# EAGLE schematic EKSR_Instrument_Rev_B (EAGLE 9.7.0)
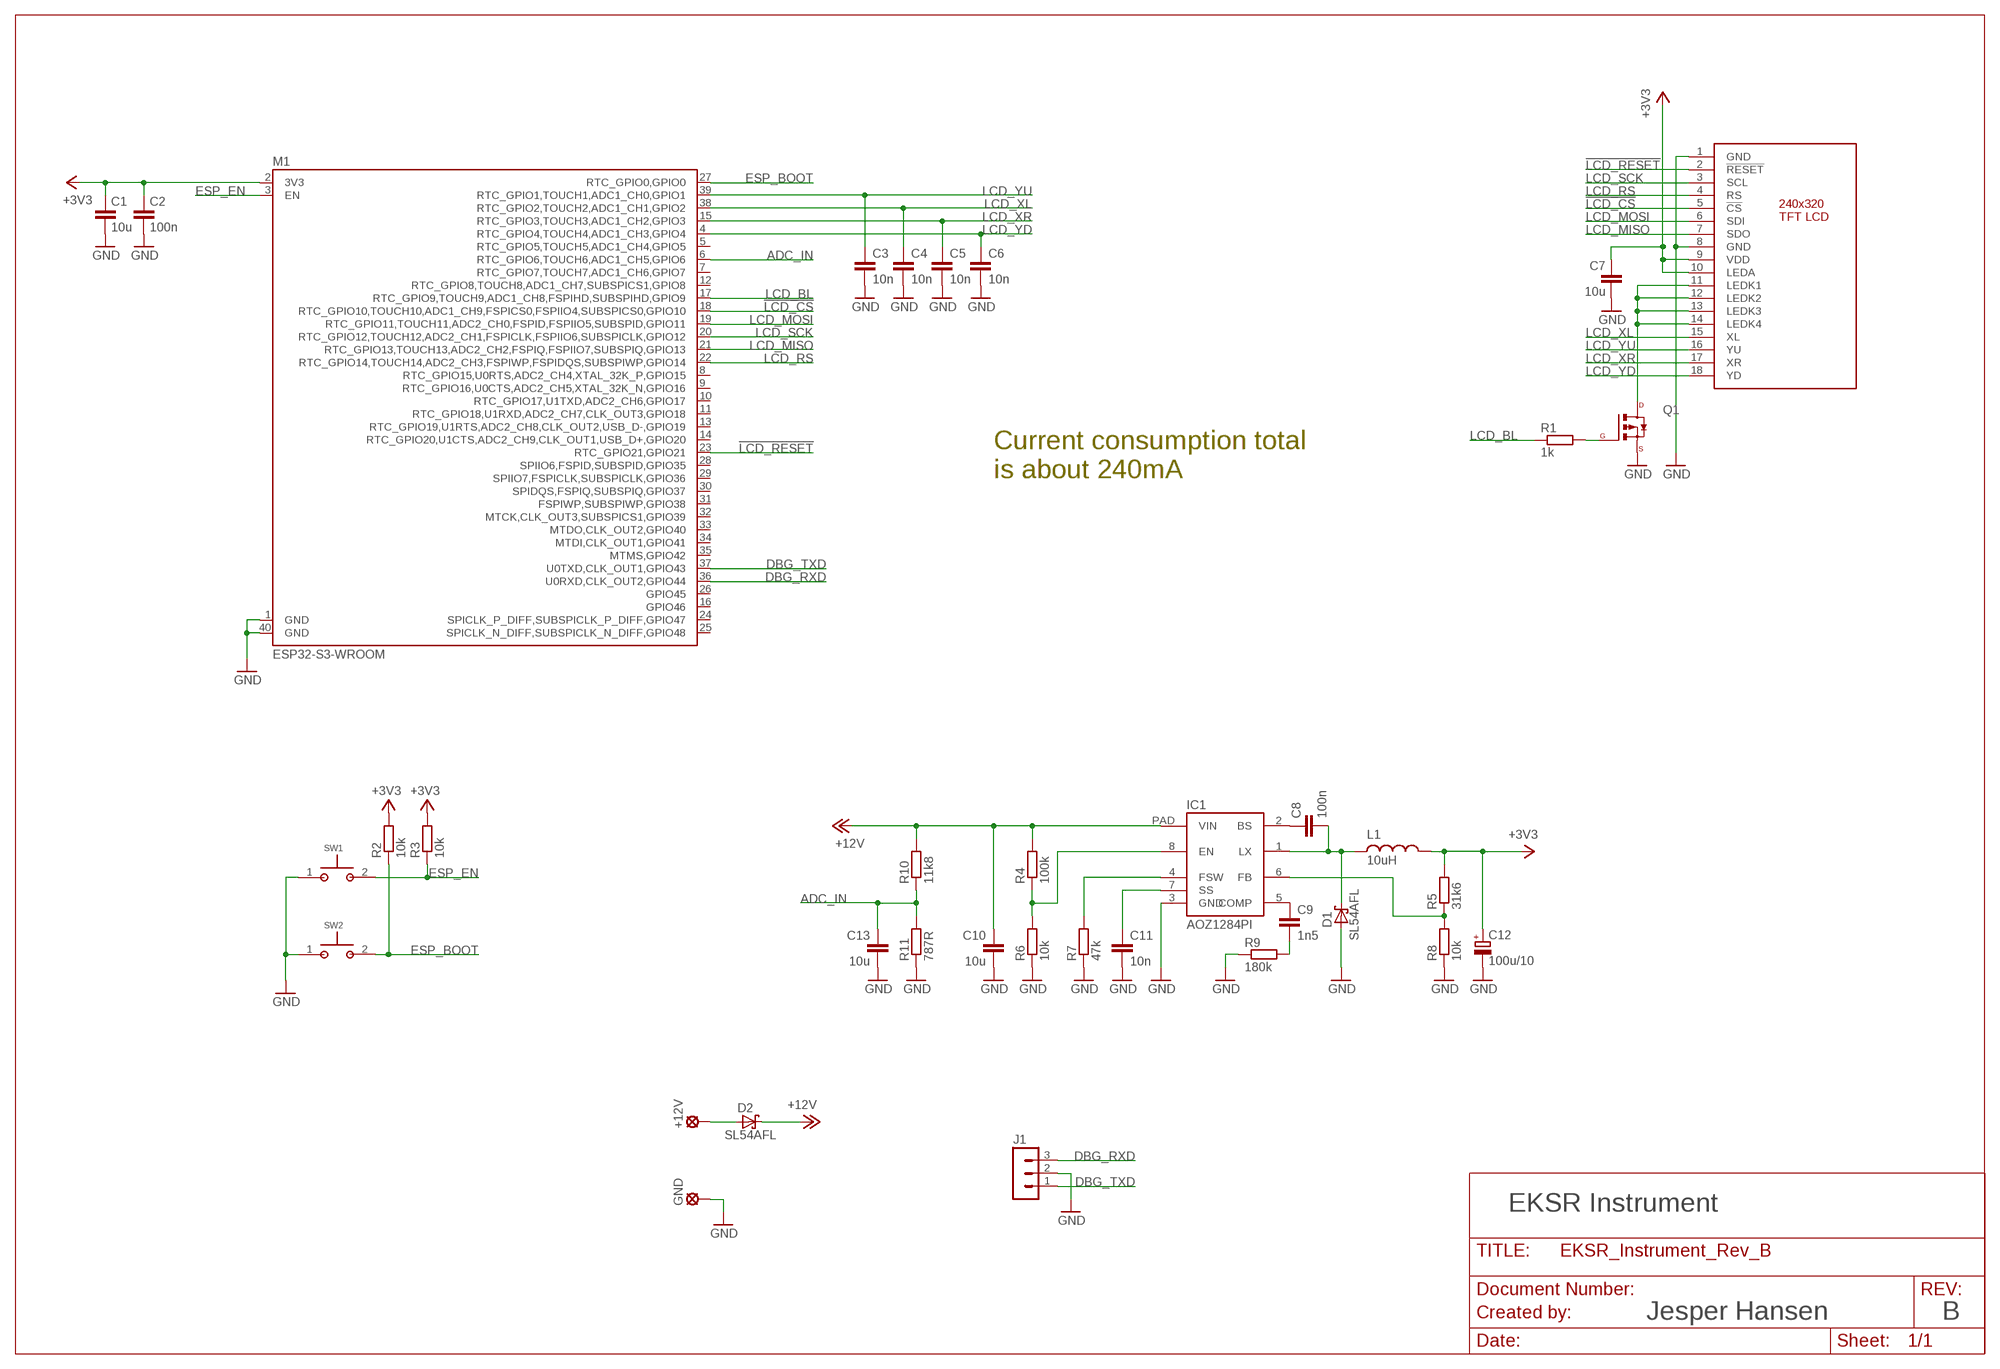
[diagram p0: schematic, sheet 1]

## Parts
+12V  LSP13  [LSP13]
C1  10u  CC0603  [C0603]
C2  100n  CC0603  [C0603]
C3  10n  CC0603  [C0603]
C4  10n  CC0603  [C0603]
C5  10n  CC0603  [C0603]
C6  10n  CC0603  [C0603]
C7  10u  CC0603  [C0603]
C8  100n  CC0603  [C0603]
C9  1n5  CC0603  [C0603]
C10  10u  CC0603  [C0603]
C11  10n  CC0603  [C0603]
C12  100u/10  CPOLCT3528  [CT3528]
C13  10u  CC0603  [C0603]
D1  SL54AFL  SCHOTTKY  [DO221-AC]
D2  SL54AFL  SCHOTTKY  [DO221-AC]
DISP1  TFT_2.4_A"  [TFT_2.4_A2]
GND  LSP13  [LSP13]
IC1  AOZ1284PI  [SO8_EDP]
J1  MA03-1W  [MA03-1W]
L1  10uH  INDUCTOR  [SPM6530]
M1  ESP32-S3-WROOM  [ESP32-S3-WROOM]
Q1  MOSFET_P  [SOT-23]
R1  1k  RR0603  [R0603]
R2  10k  RR0603  [R0603]
R3  10k  RR0603  [R0603]
R4  100k  RR0603  [R0603]
R5  31k6  RR0603  [R0603]
R6  10k  RR0603  [R0603]
R7  47k  RR0603  [R0603]
R8  10k  RR0603  [R0603]
R9  180k  RR0603  [R0603]
R10  11k8  RR0603  [R0603]
R11  787R  RR0603  [R0603]
SW1  PTS820  [PTS820]
SW2  PTS820  [PTS820]

## Nets
!LCD_CS: DISP1.5(!CS) M1.18(RTC_GPIO10,TOUCH10,ADC1_CH9,FSPICS0,FSPIIO4,SUBSPICS0,GPIO10)
!LCD_RESET: DISP1.2(!RESET) M1.23(RTC_GPIO21,GPIO21)
+3V3: C1.1 C2.1 C7.1 C12.+ DISP1.9(VDD) DISP1.10(LEDA) L1.2 M1.2(3V3) R2.2 R3.2 R5.2
+12V: C10.1 D2.C IC1.PAD(VIN) R4.2 R10.2
ADC_IN: C13.1 M1.6(RTC_GPIO6,TOUCH6,ADC1_CH5,GPIO6) R10.1 R11.2
DBG_RXD: J1.3 M1.36(U0RXD,CLK_OUT2,GPIO44)
DBG_TXD: J1.1 M1.37(U0TXD,CLK_OUT1,GPIO43)
ESP_BOOT: M1.27(RTC_GPIO0,GPIO0) R2.1 SW2.2
ESP_EN: M1.3(EN) R3.1 SW1.2
GND: C1.2 C2.2 C3.2 C4.2 C5.2 C6.2 C7.2 C10.2 C11.2 C12.- C13.2 D1.A DISP1.1(GND) DISP1.8(GND) GND.MP IC1.3(GND) J1.2 M1.1(GND) M1.40(GND) Q1.2(P_S) R6.1 R7.1 R8.1 R9.1 R11.1 SW1.1 SW2.1
LCD_BL: M1.17(RTC_GPIO9,TOUCH9,ADC1_CH8,FSPIHD,SUBSPIHD,GPIO9) R1.1
LCD_MISO: DISP1.7(SDO) M1.21(RTC_GPIO13,TOUCH13,ADC2_CH2,FSPIQ,FSPIIO7,SUBSPIQ,GPIO13)
LCD_MOSI: DISP1.6(SDI) M1.19(RTC_GPIO11,TOUCH11,ADC2_CH0,FSPID,FSPIIO5,SUBSPID,GPIO11)
LCD_RS: DISP1.4(RS) M1.22(RTC_GPIO14,TOUCH14,ADC2_CH3,FSPIWP,FSPIDQS,SUBSPIWP,GPIO14)
LCD_SCK: DISP1.3(SCL) M1.20(RTC_GPIO12,TOUCH12,ADC2_CH1,FSPICLK,FSPIIO6,SUBSPICLK,GPIO12)
LCD_XL: C4.1 DISP1.15(XL) M1.38(RTC_GPIO2,TOUCH2,ADC1_CH1,GPIO2)
LCD_XR: C5.1 DISP1.17(XR) M1.15(RTC_GPIO3,TOUCH3,ADC1_CH2,GPIO3)
LCD_YD: C6.1 DISP1.18(YD) M1.4(RTC_GPIO4,TOUCH4,ADC1_CH3,GPIO4)
LCD_YU: C3.1 DISP1.16(YU) M1.39(RTC_GPIO1,TOUCH1,ADC1_CH0,GPIO1)
N$1: IC1.6(FB) R5.1 R8.2
N$2: Q1.1(P_G) R1.2
N$3: DISP1.11(LEDK1) DISP1.12(LEDK2) DISP1.13(LEDK3) DISP1.14(LEDK4) Q1.3(P_D)
N$4: +12V.MP D2.A
N$33: IC1.8(EN) R4.1 R6.2
N$38: C8.1 IC1.2(BS)
N$39: IC1.4(FSW) R7.2
N$41: C11.1 IC1.7(SS)
N$53: C9.2 R9.2
N$54: C9.1 IC1.5(COMP)
SW: C8.2 D1.C IC1.1(LX) L1.1
Unconnected: M1.5(RTC_GPIO5,TOUCH5,ADC1_CH4,GPIO5) M1.7(RTC_GPIO7,TOUCH7,ADC1_CH6,GPIO7) M1.8(RTC_GPIO15,U0RTS,ADC2_CH4,XTAL_32K_P,GPIO15) M1.9(RTC_GPIO16,U0CTS,ADC2_CH5,XTAL_32K_N,GPIO16) M1.10(RTC_GPIO17,U1TXD,ADC2_CH6,GPIO17) M1.11(RTC_GPIO18,U1RXD,ADC2_CH7,CLK_OUT3,GPIO18) M1.12(RTC_GPIO8,TOUCH8,ADC1_CH7,SUBSPICS1,GPIO8) M1.13(RTC_GPIO19,U1RTS,ADC2_CH8,CLK_OUT2,USB_D-,GPIO19) M1.14(RTC_GPIO20,U1CTS,ADC2_CH9,CLK_OUT1,USB_D+,GPIO20) M1.16(GPIO46) M1.24(SPICLK_P_DIFF,SUBSPICLK_P_DIFF,GPIO47) M1.25(SPICLK_N_DIFF,SUBSPICLK_N_DIFF,GPIO48) M1.26(GPIO45) M1.28(SPIIO6,FSPID,SUBSPID,GPIO35) M1.29(SPIIO7,FSPICLK,SUBSPICLK,GPIO36) M1.30(SPIDQS,FSPIQ,SUBSPIQ,GPIO37) M1.31(FSPIWP,SUBSPIWP,GPIO38) M1.32(MTCK,CLK_OUT3,SUBSPICS1,GPIO39) M1.33(MTDO,CLK_OUT2,GPIO40) M1.34(MTDI,CLK_OUT1,GPIO41) M1.35(MTMS,GPIO42)

## Notes on the sheet
- Current consumption total 
  is about 240mA
- EKSR Instrument
- Created by: | Jesper Hansen | B

## Library data of the parts
+12V GND = solpad:LSP13: SOLDER PAD drill 1.3 mm, distributor Buerklin, 12H562
C1-C11 C13 = mm_rcl:C: CAPACITOR, European symbol; SPICEPREFIX: C
C12 = mm_rcl:CPOL: POLARIZED CAPACITOR, European symbol; SPICEPREFIX: C
D1 D2 = mm_diode:SCHOTTKY
DISP1 = jesper:TFT_2.4_A
IC1 = TestLib:AOZ1284PI: EZBuckTM 4A Simple Adjustable Buck Regulator 3.0 - 36V, 50mOhm, 95%, 200kHz to 2MHz Digikey #: 785-1689-1-ND
J1 = jesper:MA03-1W: Connector
L1 = mm_indmag:INDUCTOR
M1 = jesper:ESP32-S3-WROOM: ESP32-S3 WROOM module.
Q1 = jesper:MOSFET_P: General P-Channel MOSFET, various packages
R1-R11 = mm_rcl:R: RESISTOR, European symbol; SPICEPREFIX: R
SW1 SW2 = TestLib:PTS820: Microminiature SMT Top Actuated Pushbutton